# EAGLE schematic WGSwitch (EAGLE 7.3.0)
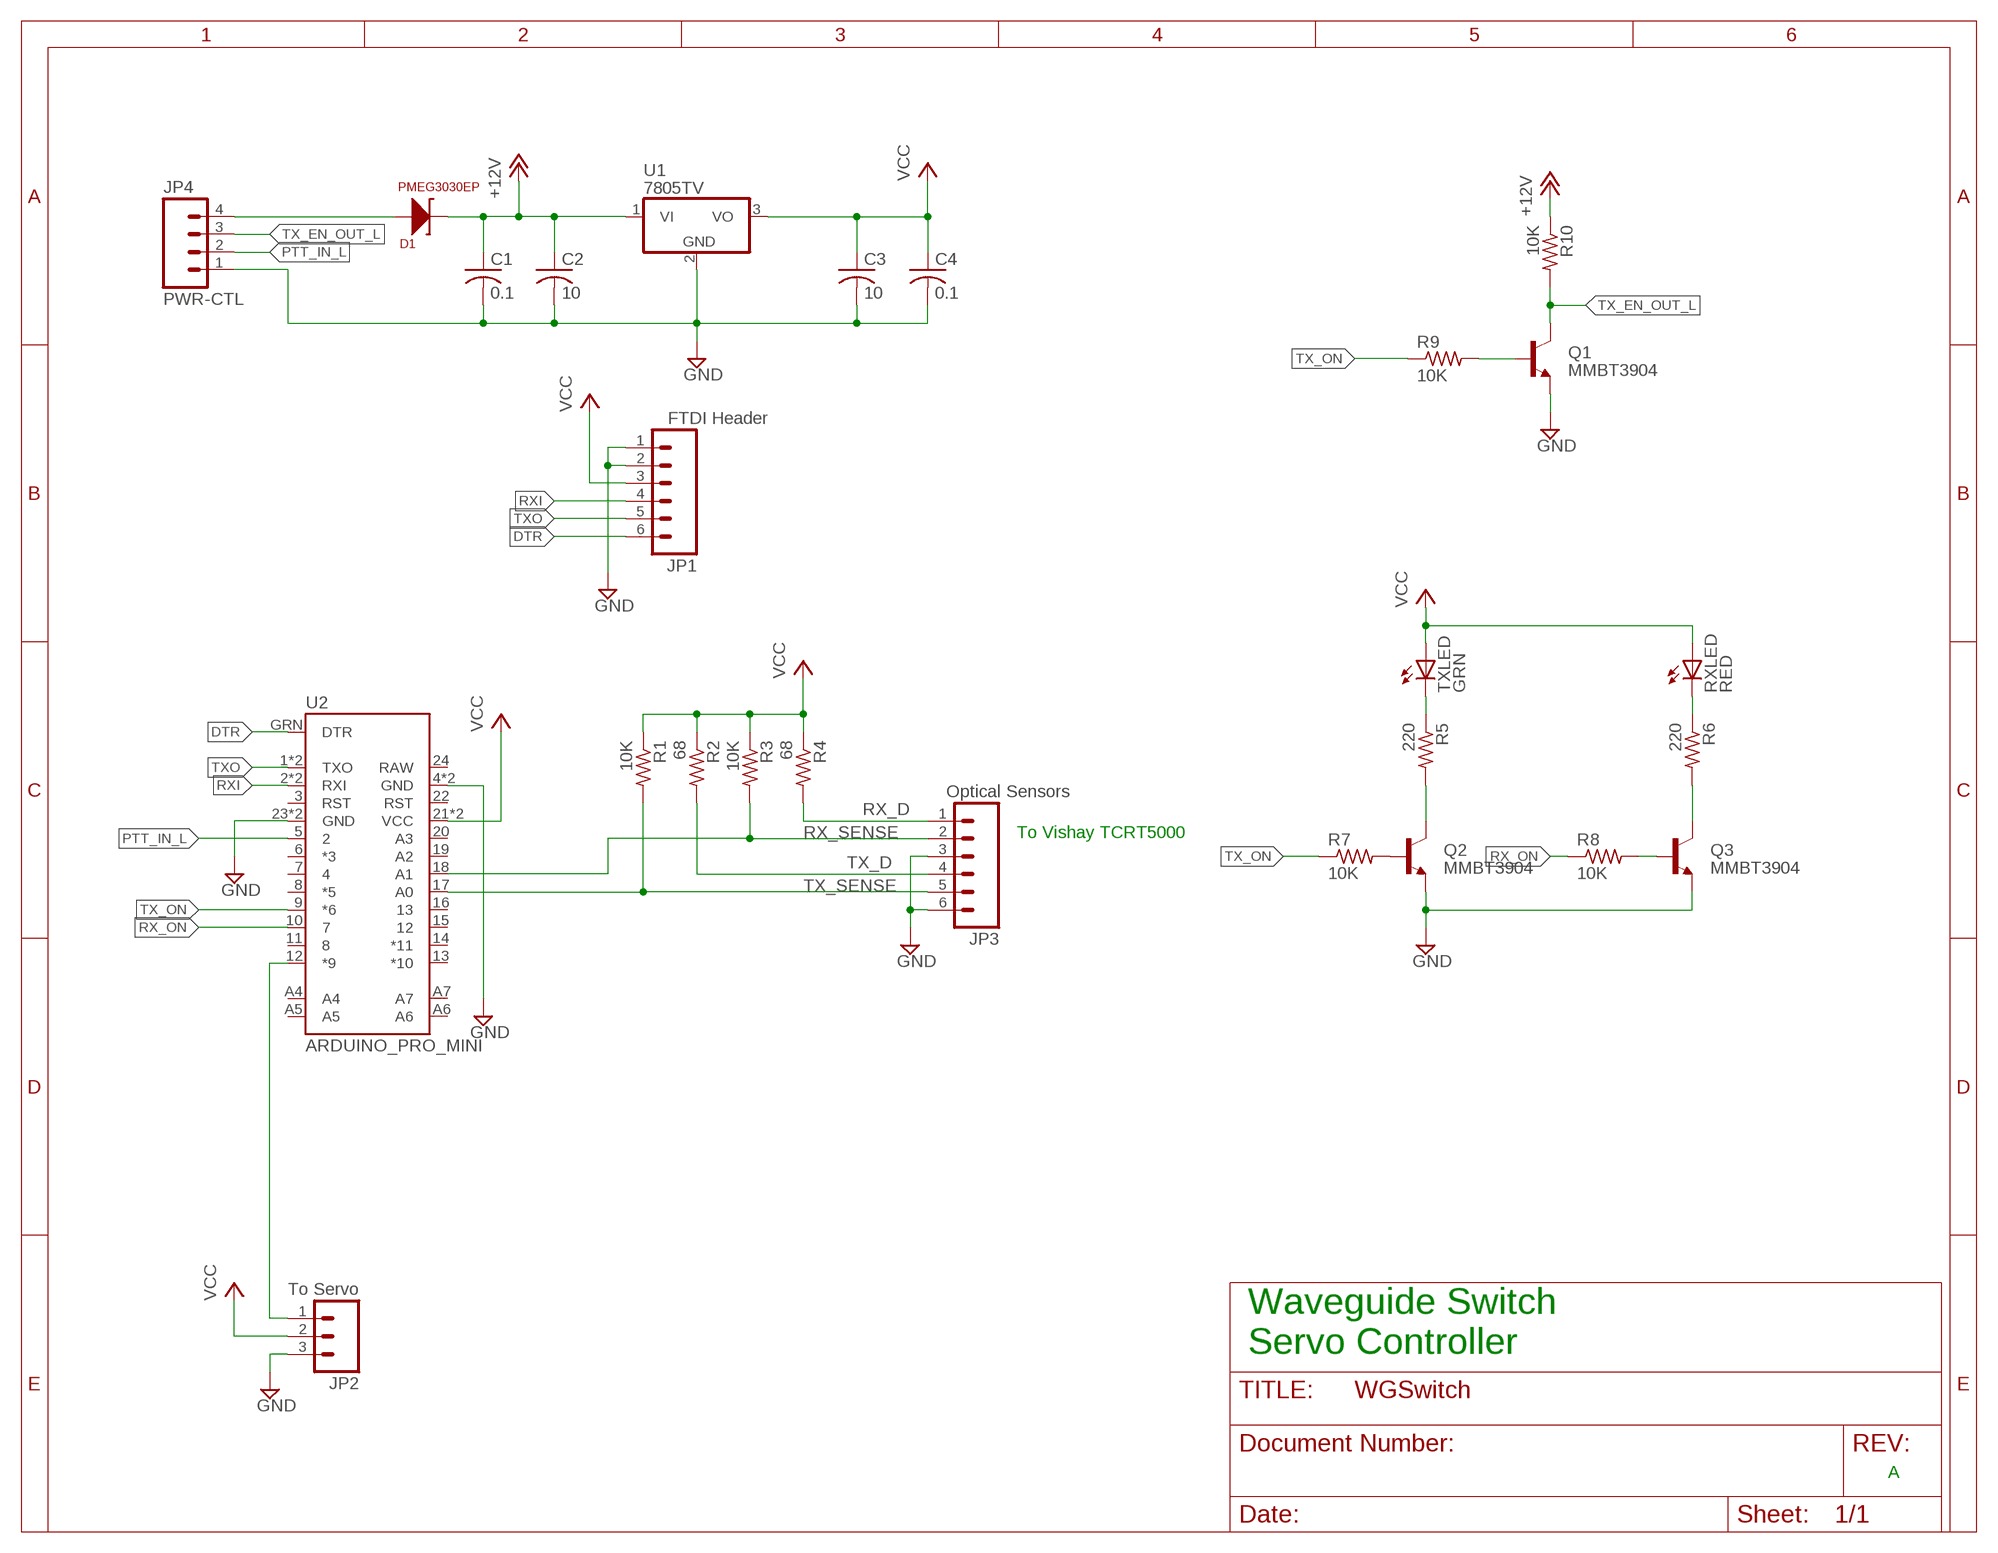
[diagram p0: schematic, sheet 1]

## Parts
C1  0.1  C-USC0805K  [C0805K]
C2  10  C-USC1206K  [C1206K]
C3  10  C-USC1206K  [C1206K]
C4  0.1  C-USC0805K  [C0805K]
D1  PMEG3030EP  [SOD128]
JP1  FTDI Header  M06SILK_FEMALE_PTH  [1X06]
JP2  To Servo  M03PTH  [1X03]
JP3  Optical Sensors  M06SILK_FEMALE_PTH  [1X06]
JP4  PWR-CTL  M04PTH  [1X04]
Q1  MMBT3904  MMBT3904-HFSOT23-3  [SOT23-3]
Q2  MMBT3904  MMBT3904-HFSOT23-3  [SOT23-3]
Q3  MMBT3904  MMBT3904-HFSOT23-3  [SOT23-3]
R1  10K  R-US_R1206  [R1206]
R2  68  R-US_R1206  [R1206]
R3  10K  R-US_R1206  [R1206]
R4  68  R-US_R1206  [R1206]
R5  220  R-US_R1206  [R1206]
R6  220  R-US_R1206  [R1206]
R7  10K  R-US_R1206  [R1206]
R8  10K  R-US_R1206  [R1206]
R9  10K  R-US_R1206  [R1206]
R10  10K  R-US_R1206  [R1206]
RXLED  RED  LED5MM  [LED5MM]
TXLED  GRN  LED5MM  [LED5MM]
U1  7805TV  [TO220V]
U2  ARDUINO_PRO_MINI  [ARDUINO_PRO_MINI]

## Nets
+12V: C1.1 C2.1 D1.P$2(C) R10.1 U1.1(VI)
DTR: JP1.6 U2.GRN(DTR)
GND: C1.2 C2.2 C3.2 C4.2 JP1.1 JP1.2 JP2.3 JP3.3 JP3.6 JP4.1 Q1.2(E) Q2.2(E) Q3.2(E) U1.2(GND) U2.4(GND) U2.23(GND) U2.BLK(GND) U2.GND
N$1: JP2.1 U2.12(*9)
N$2: Q1.1(B) R9.2
N$3: Q2.1(B) R7.2
N$4: R6.1 RXLED.K(C)
N$6: Q2.3(C) R5.2
N$7: Q3.3(C) R6.2
N$8: Q3.1(B) R8.2
N$10: D1.P$1(A) JP4.4
PTT_IN_L: JP4.2 U2.5
RX_D: JP3.1 R4.2
RX_ON: R8.1 U2.10
RX_SENSE: JP3.2 R3.2 U2.18(A1)
RXI: JP1.4 U2.2(RXI) U2.RXI
TX_D: JP3.4 R2.2
TX_EN_OUT_L: JP4.3 Q1.3(C) R10.2
TX_LED: R5.1 TXLED.K(C)
TX_ON: R7.1 R9.1 U2.9(*6)
TX_SENSE: JP3.5 R1.2 U2.17(A0)
TXO: JP1.5 U2.1(TXO) U2.TXO
VCC: C3.1 C4.1 JP1.3 JP2.2 R1.1 R2.1 R3.1 R4.1 RXLED.A TXLED.A U1.3(VO) U2.21(VCC) U2.VCC
Unconnected: U2.3(RST) U2.6(*3) U2.7 U2.8(*5) U2.11 U2.13(*10) U2.14(*11) U2.15 U2.16 U2.19(A2) U2.20(A3) U2.22(RST) U2.24(RAW) U2.A4 U2.A5 U2.A6 U2.A7

## Notes on the sheet
- To Vishay TCRT5000
- Waveguide Switch
  Servo Controller
- A

## Library data of the parts
C1-C4 = rcl:C-US: CAPACITOR, American symbol
D1 = kb1vc_robot_parts:PMEG3030EP
JP1 JP3 = SparkFun-Connectors:M06: Header 6 Standard 6-pin 0.1" header. Use with straight break away headers (SKU : PRT-00116), right angle break away headers (PRT-00553), swiss pins (PRT-00743), machine pins (PRT-00117), and female headers (PRT-00115). Molex polarized connector foot print use with SKU : PRT-08094 with associated crimp pins and housings. NOTES ON THE VARIANTS LOCK and LOCK_LONGPADS... This footprint was designed to help hold the alignment of a through-hole component (i.e. 6-pin header) while soldering it into place. You may notice that each hole has been shifted either up or down by 0.005 of an inch from it's more standard position (which is a perfectly straight line). This slight alteration caused the pins (the squares in the middle) to touch the edges of the holes. Because they are alternating, it causes a "brace" to hold the component in place. 0.005 has proven to be the perfect amount of "off-center" position when using our standard breakaway headers. Although looks a little odd when you look at the bare footprint, once you have a header in there, the alteration is very hard to notice. Also,if you push a header all the way into place, it is covered up entirely on the bottom side. This idea of altering the position of holes to aid alignment will be further integrated into the Sparkfun Library for other footprints. It can help hold any component with 3 or more connection pins.; PROD_ID: CONN-08437
JP2 = SparkFun-Connectors:M03: Header 3 Standard 3-pin 0.1" header. Use with straight break away headers (SKU : PRT-00116), right angle break away headers (PRT-00553), swiss pins (PRT-00743), machine pins (PRT-00117), and female headers (PRT-00115). Molex polarized connector foot print use with SKU : PRT-08232 with associated crimp pins and housings.
JP4 = SparkFun-Connectors:M04: Header 4 Standard 4-pin 0.1" header. Use with straight break away headers (SKU : PRT-00116), right angle break away headers (PRT-00553), swiss pins (PRT-00743), machine pins (PRT-00117), and female headers (PRT-00115). Molex polarized connector foot print use with SKU : PRT-08231 with associated crimp pins and housings. 1MM SMD Version SKU: PRT-10208
Q1-Q3 = kb1vc_Arduino_Parts:MMBT3904-HF: Generic NPN BJT MMBT2222A - TRANS-08049 (SOT-23, 1A 40V) MPSA42 - TRANS-09116 (SOT-23, 500mA 300V) MMBT5088LT1G - TRANS-11160 (SOT-23, 50 mA 30V) BC547 - COM-08928 <http://www.sparkfun.com/products/8928> (TO-92 45V 100mA) (1.Collector 2.Base 3.Emitter) 2N3904 - COM-00521 <http://www.sparkfun.com/products/521> (TO-92 40V 200mA) (1.Emitter 2.Base 3.Collector) P2N2222A - COM-12852 <http://www.sparkfun.com/products/12852> (TO-92 40V 600mA) (1.Collector 2.Base 3.Emitter); PROD_ID: TRANS-08049
R1-R10 = rcl:R-US_: RESISTOR, American symbol
RXLED TXLED = led:LED: LED OSRAM: - CHIPLED LG R971, LG N971, LY N971, LG Q971, LY Q971, LO R971, LY R971 LH N974, LH R974 LS Q976, LO Q976, LY Q976 LO Q996 - Hyper CHIPLED LW Q18S LB Q993, LB Q99A, LB R99A - SideLED LS A670, LO A670, LY A670, LG A670, LP A670 LB A673, LV A673, LT A673, LW A673 LH A674 LY A675 LS A676, LA A676, LO A676, LY A676, LW A676 LS A679, LY A679, LG A679 - Hyper Micro SIDELED® LS Y876, LA Y876, LO Y876, LY Y876 LT Y87S - SmartLED LW L88C, LW L88S LB L89C, LB L89S, LG L890 LS L89K, LO L89K, LY L89K LS L896, LA L896, LO L896, LY L896 - TOPLED LS T670, LO T670, LY T670, LG T670, LP T670 LSG T670, LSP T670, LSY T670, LOP T670, LYG T670 LG T671, LOG T671, LSG T671 LB T673, LV T673, LT T673, LW T673 LH T674 LS T676, LA T676, LO T676, LY T676, LB T676, LH T676, LSB T676, LW T676 LB T67C, LV T67C, LT T67C, LS T67K, LO T67K, LY T67K, LW E67C LS E67B, LA E67B, LO E67B, LY E67B, LB E67C, LV E67C, LT E67C LW T67C LS T679, LY T679, LG T679 LS T770, LO T770, LY T770, LG T770, LP T770 LB T773, LV T773, LT T773, LW T773 LH T774 LS E675, LA E675, LY E675, LS T675 LS T776, LA T776, LO T776, LY T776, LB T776 LHGB T686 LT T68C, LB T68C - Hyper Mini TOPLED® LB M676 - Mini TOPLED Santana® LG M470 LS M47K, LO M47K, LY M47K Source: http://www.osram.convergy.de LUXEON: - LUMILED® LXK2-PW12-R00, LXK2-PW12-S00, LXK2-PW14-U00, LXK2-PW14-V00 LXK2-PM12-R00, LXK2-PM12-S00, LXK2-PM14-U00 LXK2-PE12-Q00, LXK2-PE12-R00, LXK2-PE12-S00, LXK2-PE14-T00, LXK2-PE14-U00 LXK2-PB12-K00, LXK2-PB12-L00, LXK2-PB12-M00, LXK2-PB14-N00, LXK2-PB14-P00, LXK2-PB14-Q00 LXK2-PR12-L00, LXK2-PR12-M00, LXK2-PR14-Q00, LXK2-PR14-R00 LXK2-PD12-Q00, LXK2-PD12-R00, LXK2-PD12-S00 LXK2-PH12-R00, LXK2-PH12-S00 LXK2-PL12-P00, LXK2-PL12-Q00, LXK2-PL12-R00 Source: www.luxeon.com KINGBRIGHT: KA-3528ASYC Source: www.kingbright.com
U1 = linear:78*: Positive VOLTAGE REGULATOR Source: http://cache.national.com/ds/LM/LM78L05.pdf http://www.fairchildsemi.com/ds/LM/LM7805.pdf
U2 = kb1vc_Arduino_Parts:ARDUINO_PRO_MINI